# EAGLE design can-weichendecoder-magnet_0_2 (EAGLE 7.2.0)
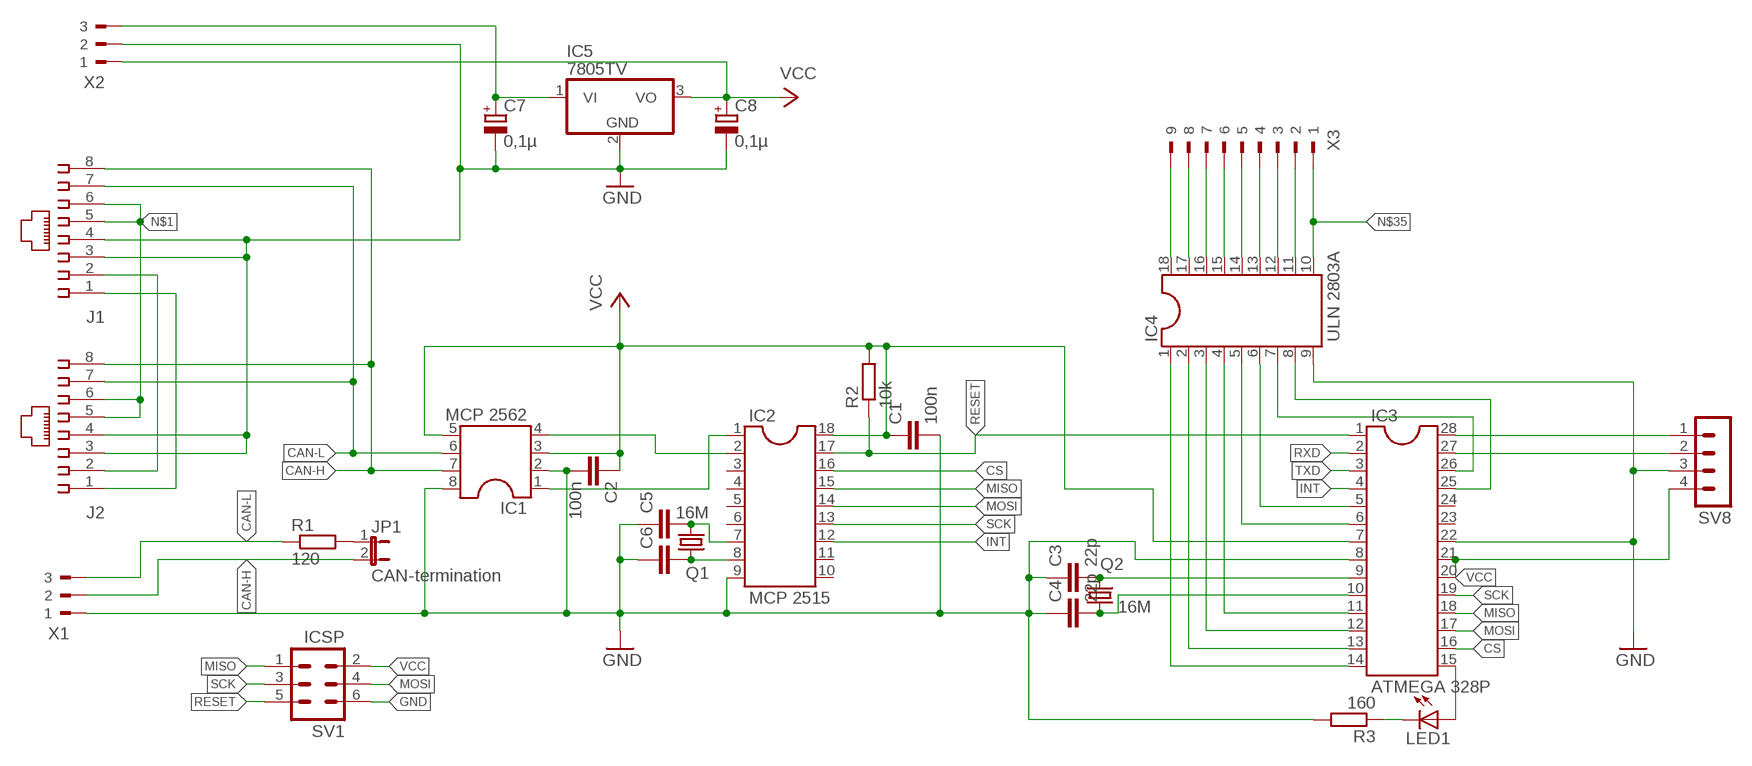
[diagram p0: schematic, sheet 1]

## Parts
C1  100n  C-EUC0805  [C0805]
C2  100n  C-EUC0805  [C0805]
C3  22p  C-EUC0805  [C0805]
C4  22p  C-EUC0805  [C0805]
C5  C-EUC0805  [C0805]
C6  C-EUC0805  [C0805]
C7  0,1µ  CPOL-EUE2.5-6  [E2,5-6]
C8  0,1µ  CPOL-EUE2.5-6  [E2,5-6]
IC1  MCP 2562  DIL8S  [SOCKET-08]
IC2  MCP 2515  DIL18S  [SOCKET-18]
IC3  ATMEGA 328P  DIL28-3  [DIL28-3]
IC4  ULN 2803A  DIL18S  [SOCKET-18]
IC5  7805TV  [TO220V]
J1  215877-7  [215877-7]
J2  215877-7  [215877-7]
JP1  CAN-termination  JP1E  [JP1]
LED1  LEDCHIP-LED0805  [CHIP-LED0805]
Q1  16M  CRYSTALHC49S  [HC49/S]
Q2  16M  CRYSTALHC49S  [HC49/S]
R1  120  R-EU_R0805  [R0805]
R2  10k  R-EU_R0805  [R0805]
R3  160  R-EU_R0805  [R0805]
SV1  ICSP  MA03-2  [MA03-2]
SV8  MA04-1  [MA04-1]
X1  90-3  [90-3]
X2  90-3  [90-3]
X3  90-9  [90-9]

## Nets
18V: C7.+ IC5.1(VI) X2.3
CAN-H: IC1.7 J1.8 J2.8 JP1.2 X1.2
CAN-L: IC1.6 J1.7 J2.7 R1.1 X1.3
CS: IC2.16 IC3.16
GND: C1.2 C2.2 C3.1 C4.1 C5.1 C6.1 C7.- C8.- IC1.2 IC1.8 IC2.9 IC3.8 IC3.22 IC4.9 IC5.2(GND) J1.3 J1.4 J2.3 J2.4 R3.2 SV1.6 SV8.3 X1.1 X2.2
INT: IC2.12 IC3.4
MISO: IC2.15 IC3.18 SV1.1
MOSI: IC2.14 IC3.17 SV1.4
N$1: J1.5 J1.6 J2.5 J2.6
N$2: IC1.4 IC2.2
N$3: J1.2 J2.2
N$4: C6.2 IC2.8 Q1.1
N$5: JP1.1 R1.2
N$6: C5.2 IC2.7 Q1.2
N$7: C3.2 IC3.9 Q2.2
N$8: C4.2 IC3.10 Q2.1
N$9: IC1.1 IC2.1
N$10: IC3.26 IC4.7
N$11: IC3.25 IC4.8
N$12: LED1.C R3.1
N$13: IC3.15 LED1.A
N$14: IC3.5 IC4.6
N$15: IC3.6 IC4.5
N$16: IC3.11 IC4.4
N$17: IC3.12 IC4.3
N$18: IC3.13 IC4.2
N$19: IC3.14 IC4.1
N$20: IC4.11 X3.2
N$21: IC4.12 X3.3
N$22: IC4.13 X3.4
N$23: IC4.14 X3.5
N$24: IC4.15 X3.6
N$25: IC4.16 X3.7
N$26: IC4.17 X3.8
N$27: IC4.18 X3.9
N$32: J1.1 J2.1
N$33: IC3.28 SV8.1
N$34: IC3.27 SV8.2
N$35: IC4.10 X3.1
RESET: IC2.17 IC3.1 R2.1 SV1.5
RXD: IC3.2
SCK: IC2.13 IC3.19 SV1.3
TXD: IC3.3
VCC: C1.1 C2.1 C8.+ IC1.3 IC1.5 IC2.18 IC3.7 IC3.20 IC3.21 IC5.3(VO) R2.2 SV1.2 SV8.4 X2.1
Unconnected: IC2.3 IC2.4 IC2.5 IC2.6 IC2.10 IC2.11 IC3.23 IC3.24

## Library data of the parts
C1-C6 = rcl:C-EU: CAPACITOR, European symbol
C7 C8 = rcl:CPOL-EU: POLARIZED CAPACITOR, European symbol
IC1 = ic-package:DIL8: Dual In Line / Socket
IC2 IC4 = ic-package:DIL18: Dual In Line / Socket
IC3 = ic-package:DIL28: Dual In Line
IC5 = linear:78*: Positive VOLTAGE REGULATOR Source: http://cache.national.com/ds/LM/LM78L05.pdf http://www.fairchildsemi.com/ds/LM/LM7805.pdf
J1 J2 = con-amp:215877-7: AMP connector
JP1 = jumper:JP1E: JUMPER
LED1 = led:LED: LED OSRAM: - CHIPLED LG R971, LG N971, LY N971, LG Q971, LY Q971, LO R971, LY R971 LH N974, LH R974 LS Q976, LO Q976, LY Q976 LO Q996 - Hyper CHIPLED LW Q18S LB Q993, LB Q99A, LB R99A - SideLED LS A670, LO A670, LY A670, LG A670, LP A670 LB A673, LV A673, LT A673, LW A673 LH A674 LY A675 LS A676, LA A676, LO A676, LY A676, LW A676 LS A679, LY A679, LG A679 - Hyper Micro SIDELED® LS Y876, LA Y876, LO Y876, LY Y876 LT Y87S - SmartLED LW L88C, LW L88S LB L89C, LB L89S, LG L890 LS L89K, LO L89K, LY L89K LS L896, LA L896, LO L896, LY L896 - TOPLED LS T670, LO T670, LY T670, LG T670, LP T670 LSG T670, LSP T670, LSY T670, LOP T670, LYG T670 LG T671, LOG T671, LSG T671 LB T673, LV T673, LT T673, LW T673 LH T674 LS T676, LA T676, LO T676, LY T676, LB T676, LH T676, LSB T676, LW T676 LB T67C, LV T67C, LT T67C, LS T67K, LO T67K, LY T67K, LW E67C LS E67B, LA E67B, LO E67B, LY E67B, LB E67C, LV E67C, LT E67C LW T67C LS T679, LY T679, LG T679 LS T770, LO T770, LY T770, LG T770, LP T770 LB T773, LV T773, LT T773, LW T773 LH T774 LS E675, LA E675, LY E675, LS T675 LS T776, LA T776, LO T776, LY T776, LB T776 LHGB T686 LT T68C, LB T68C - Hyper Mini TOPLED® LB M676 - Mini TOPLED Santana® LG M470 LS M47K, LO M47K, LY M47K Source: http://www.osram.convergy.de LUXEON: - LUMILED® LXK2-PW12-R00, LXK2-PW12-S00, LXK2-PW14-U00, LXK2-PW14-V00 LXK2-PM12-R00, LXK2-PM12-S00, LXK2-PM14-U00 LXK2-PE12-Q00, LXK2-PE12-R00, LXK2-PE12-S00, LXK2-PE14-T00, LXK2-PE14-U00 LXK2-PB12-K00, LXK2-PB12-L00, LXK2-PB12-M00, LXK2-PB14-N00, LXK2-PB14-P00, LXK2-PB14-Q00 LXK2-PR12-L00, LXK2-PR12-M00, LXK2-PR14-Q00, LXK2-PR14-R00 LXK2-PD12-Q00, LXK2-PD12-R00, LXK2-PD12-S00 LXK2-PH12-R00, LXK2-PH12-S00 LXK2-PL12-P00, LXK2-PL12-Q00, LXK2-PL12-R00 Source: www.luxeon.com KINGBRIGHT: KA-3528ASYC Source: www.kingbright.com
Q1 Q2 = crystal:CRYSTAL: CRYSTAL; OC_FARNELL: 1667008; OC_NEWARK: unknown
R1-R3 = rcl:R-EU_: RESISTOR, European symbol
SV1 = con-lstb:MA03-2: PIN HEADER; OC_FARNELL: unknown; OC_NEWARK: unknown
SV8 = con-lstb:MA04-1: PIN HEADER; OC_FARNELL: unknown; OC_NEWARK: unknown
X1 X2 = con-weidmueller-sl35:90-3: WEIDMUELLER CLAMP CONNECTOR; OC_FARNELL: unknown; OC_NEWARK: unknown
X3 = con-weidmueller-sl35:90-9: WEIDMUELLER CLAMP CONNECTOR; OC_FARNELL: unknown; OC_NEWARK: unknown

## Board
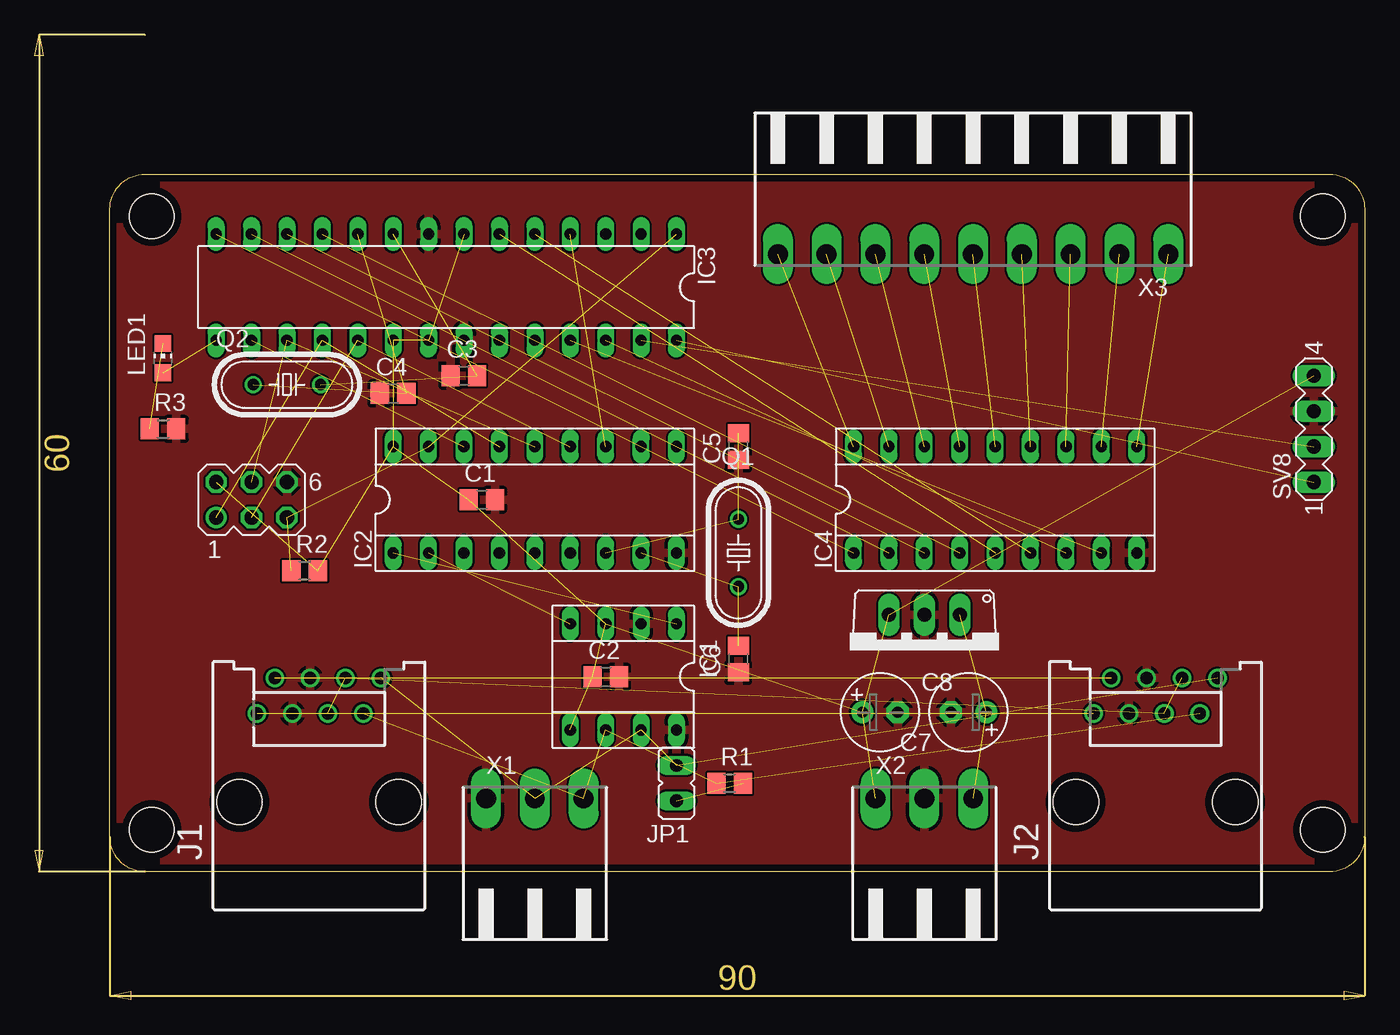
[diagram p1: board, top side]
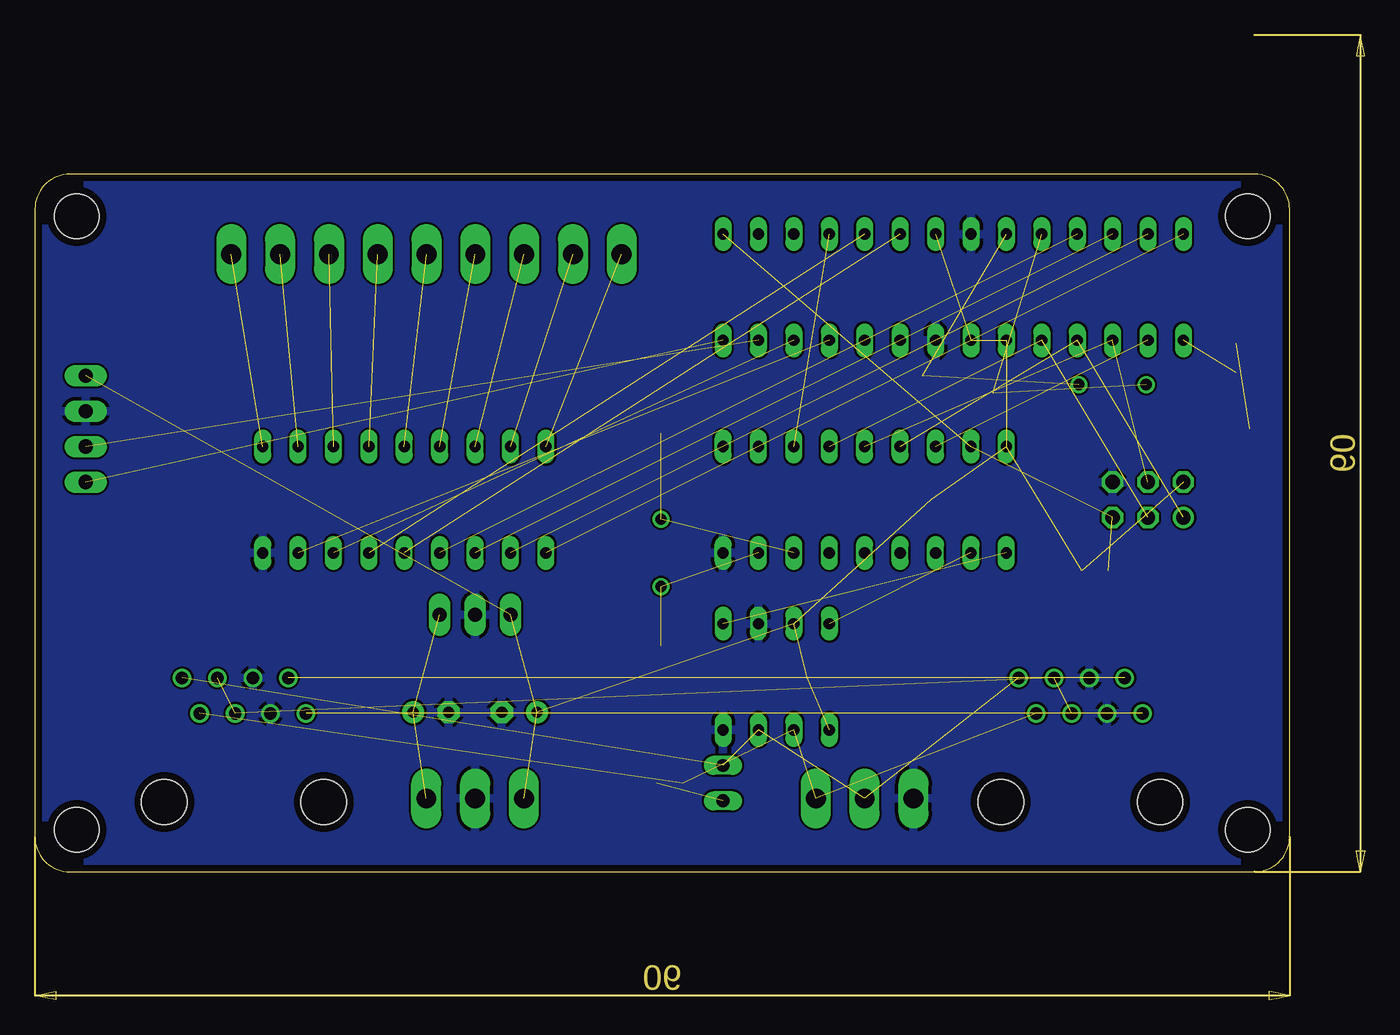
[diagram p2: board, bottom side, seen from below]

Size 90 x 50 mm. Coordinates in mm from the lower left corner, seen from the top.
Outline: 0,47.5 arc-90 2.5,50 87.5,50 arc-90 90,47.5 90,2.5 arc-90 87.5,0 2.5,0 arc-90 0,2.5 0,47.5
Copper layers (1*16): Top 0.035mm / dielectric 1.6mm / Bottom 0.035mm
Design rules "Elecrow_2-layer_PCB_eagle_rule": minimum track width 6mil, minimum drill 12mil, track to track 6mil, track to pad 6mil, pad to pad 6mil, via to via 8mil, smd to smd 0mil, copper to edge 20mil, drill to drill 10mil, minimum pad ring 6mil, minimum via ring 6mil, stop-mask expansion 0mil, vias tented up to drill 100mil, thermal gap 10mil
Holes 3.2 mm at 3,3 87,3 87,47 3,47

### Footprints (pad centres in the part's own frame; a part is rotated, then mirrored left to right if it is on the bottom)
C0805 = smd 1.3 x 1.5: 1 -0.95,0; 2 0.95,0
E2,5-6 = drill 0.813 pad 1.6: + -1.27,0 | drill 0.813 pad 1.6 octagon: - 1.27,0
SOCKET-08 = drill 0.813 long: 1 -3.81,-3.81; 2 -1.27,-3.81; 3 1.27,-3.81; 4 3.81,-3.81; 5 3.81,3.81; 6 1.27,3.81; 7 -1.27,3.81; 8 -3.81,3.81
SOCKET-18 = drill 0.813 long: 1 -10.16,-3.81; 2 -7.62,-3.81; 3 -5.08,-3.81; 4 -2.54,-3.81; 5 0,-3.81; 6 2.54,-3.81; 7 5.08,-3.81; 8 7.62,-3.81; 9 10.16,-3.81; 10 10.16,3.81; 11 7.62,3.81; 12 5.08,3.81; 13 2.54,3.81; 14 0,3.81; 15 -2.54,3.81; 16 -5.08,3.81; 17 -7.62,3.81; 18 -10.16,3.81
DIL28-3 = drill 0.813 long: 1 -16.51,-3.81; 2 -13.97,-3.81; 3 -11.43,-3.81; 4 -8.89,-3.81; 5 -6.35,-3.81; 6 -3.81,-3.81; 7 -1.27,-3.81; 8 1.27,-3.81; 9 3.81,-3.81; 10 6.35,-3.81; 11 8.89,-3.81; 12 11.43,-3.81; 13 13.97,-3.81; 14 16.51,-3.81; 15 16.51,3.81; 16 13.97,3.81; 17 11.43,3.81; 18 8.89,3.81; 19 6.35,3.81; 20 3.81,3.81; 21 1.27,3.81; 22 -1.27,3.81; 23 -3.81,3.81; 24 -6.35,3.81; 25 -8.89,3.81; 26 -11.43,3.81; 27 -13.97,3.81; 28 -16.51,3.81
TO220V = drill 1.016 long: 1 -2.54,-2.54; 2 0,-2.54; 3 2.54,-2.54
215877-7 = drill 0.889: 1 -4.445,6.35; 2 -3.175,8.89; 3 -1.905,6.35; 4 -0.635,8.89; 5 0.635,6.35; 6 1.905,8.89; 7 3.175,6.35; 8 4.445,8.89 | hole 3.251: -5.715,0; 5.715,0
JP1 = drill 0.914 long: 1 0,-1.27; 2 0,1.27
CHIP-LED0805 = smd 1.2 x 1.2: A 0,-1.05; C 0,1.05
HC49/S = drill 0.813: 1 -2.413,0; 2 2.413,0
R0805 = smd 1.3 x 1.5: 1 -0.95,0; 2 0.95,0
MA03-2 = drill 1.016: 1 -2.54,-1.27 | drill 1.016 octagon: 2 -2.54,1.27; 3 0,-1.27; 4 0,1.27; 5 2.54,-1.27; 6 2.54,1.27
MA04-1 = drill 1.016 long: 1 -3.81,0; 2 -1.27,0; 3 1.27,0; 4 3.81,0
90-3 = drill 1.422 long: 1 -3.5,5.25; 2 0,5.25; 3 3.5,5.25
90-9 = drill 1.422 long: 1 -14,5.25; 2 -10.5,5.25; 3 -7,5.25; 4 -3.5,5.25; 5 0,5.25; 6 3.5,5.25; 7 7,5.25; 8 10.5,5.25; 9 14,5.25

### Placement (x,y rotation side)
C1  26.67,26.67 0 top
C2  35.56,13.97 0 top
C3  25.4,35.56 0 top
C4  20.32,34.29 0 top
C5  45.09,30.48 90 top
C6  45.09,15.24 90 top
C7  61.59,11.43 180 top
C8  55.24,11.43 0 top
IC1  36.83,13.97 180 top
IC2  30.48,26.67 0 top
IC3  24.13,41.91 180 top
IC4  63.5,26.67 0 top
IC5  58.42,15.88 180 top
J1  15,5 0 top
J2  75,5 0 top
JP1  40.64,6.35 0 top
LED1  3.81,36.83 0 top
Q1  45.09,22.86 90 top
Q2  12.7,34.92 0 top
R1  44.45,6.35 0 top
R2  13.97,21.59 0 top
R3  3.81,31.75 0 top
SV1  10.16,26.67 0 top
SV8  86.36,31.75 90 top
X1  30.48,0 0 top
X2  58.42,0 0 top
X3  61.91,49.53 180 top

### Tracks (layer width: path | path; a pad name or v marks a point on that pad's centre or on a via)
18V  (2 unrouted)
CAN-H  (4 unrouted)
CAN-L  (4 unrouted)
CS  (1 unrouted)
GND
  pour Top: -1.27,-1.27 91.44,-1.27 91.44,60.96 -1.27,60.96
  pour Bottom: -1.27,-1.27 91.44,-1.27 91.44,60.96 -1.27,60.96
INT  (1 unrouted)
MISO  (2 unrouted)
MOSI  (2 unrouted)
N$1  (3 unrouted)
N$2  (1 unrouted)
N$3  (1 unrouted)
N$4  (2 unrouted)
N$5  (1 unrouted)
N$6  (2 unrouted)
N$7  (2 unrouted)
N$8  (2 unrouted)
N$9  (1 unrouted)
N$10  (1 unrouted)
N$11  (1 unrouted)
N$12  (1 unrouted)
N$13  (1 unrouted)
N$14  (1 unrouted)
N$15  (1 unrouted)
N$16  (1 unrouted)
N$17  (1 unrouted)
N$18  (1 unrouted)
N$19  (1 unrouted)
N$20  (1 unrouted)
N$21  (1 unrouted)
N$22  (1 unrouted)
N$23  (1 unrouted)
N$24  (1 unrouted)
N$25  (1 unrouted)
N$26  (1 unrouted)
N$27  (1 unrouted)
N$32  (1 unrouted)
N$33  (1 unrouted)
N$34  (1 unrouted)
N$35  (1 unrouted)
RESET  (3 unrouted)
SCK  (2 unrouted)
VCC  (13 unrouted)